# Altium schematic sheet Sheet1.SchDoc
size A4; SheetNumber: 1; SheetTotal: 1
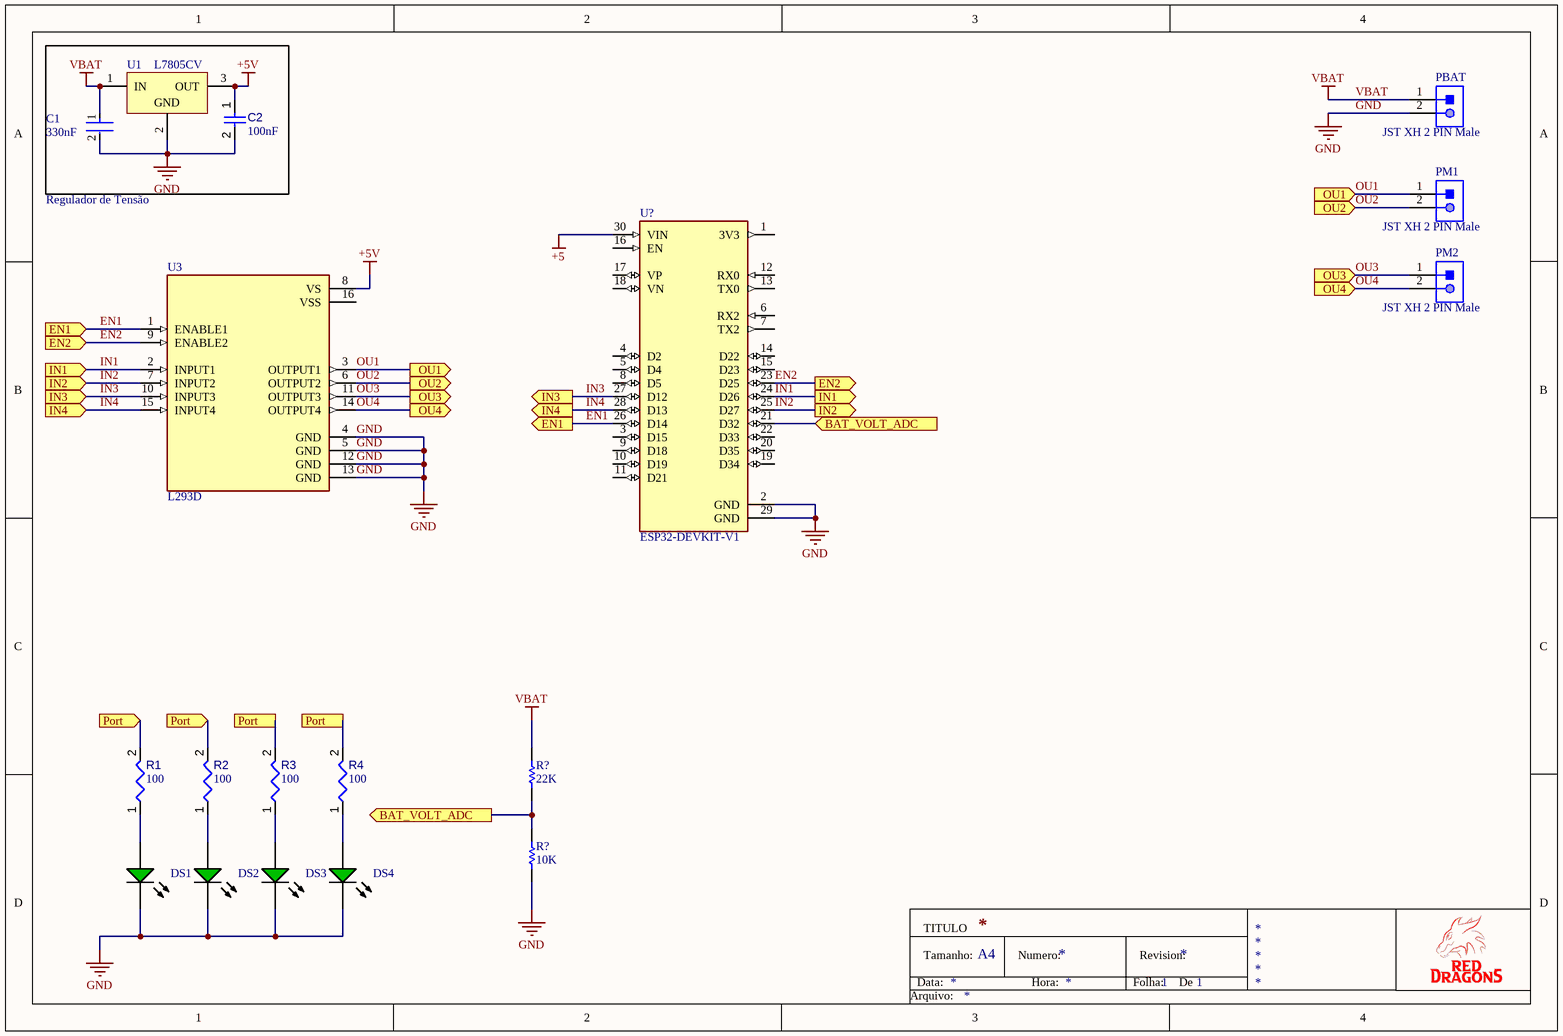
[diagram p0: Sheet1.SchDoc]

## Parts
(Parts that share a designator on the sheet are numbered #1, #2 ... from top to bottom, then left to right.)
C1  330nF  [FP-0805-L_2_01_0_2-W_1_25-IPC_B]
C2  value 100nF  [CAPC1005X56X25LL10T15]  (hidden comment: Capacitor 0.1 uF +/- 5% 16 V 0402)
DS1  LTL-1CHG  [LTST-LTL-1CHG-2]  (value not drawn)
DS2  LTL-1CHG  [LTST-LTL-1CHG-2]  (value not drawn)
DS3  LTL-1CHG  [LTST-LTL-1CHG-2]  (value not drawn)
DS4  LTL-1CHG  [LTST-LTL-1CHG-2]  (value not drawn)
PBAT  JST XH 2 PIN Male  [JST-S2B-PH-K-S_V]
PM1  JST XH 2 PIN Male  [JST-S2B-PH-K-S_V]
PM2  JST XH 2 PIN Male  [JST-S2B-PH-K-S_V]
R1  value 100  [RESC0402(1005)_L]  (hidden comment: 100R2F)
R2  value 100  [RESC0402(1005)_L]  (hidden comment: 100R2F)
R3  value 100  [RESC0402(1005)_L]  (hidden comment: 100R2F)
R4  value 100  [RESC0402(1005)_L]  (hidden comment: 100R2F)
R?#1  value 22K  [RES0805]  (hidden comment: Res1)
R?#2  value 10K  [RES0805]  (hidden comment: Res1)
U1  L7805CV  [TO220]
U3  L293D  [DIP880W50P254L2000H510Q16]
U?  ESP32-DEVKIT-V1  [MODULE_ESP32_DEVKIT_V1]

## Ports
BAT_VOLT_ADC (in), BAT_VOLT_ADC (out), EN1 (in), EN1 (out), EN2 (in), EN2 (out), IN1 (in), IN1 (out), IN2 (in), IN2 (out), IN3 (in), IN3 (out), IN4 (in), IN4 (out), OU1 (in), OU1 (out), OU2 (in), OU2 (out), OU3 (in), OU3 (out), OU4 (in), OU4 (out), Port, Port (in)

## Nets
+5: U?.30(VIN)
+5V: C2.1 U1.3(OUT) U3.8(VS)
GND: C1.2 C2.2 DS1.2(K) DS2.2(K) DS3.2(K) DS4.2(K) PBAT.2 R?#2.1 U1.2(GND) U3.4(GND) U3.5(GND) U3.12(GND) U3.13(GND) U?.2(GND) U?.29(GND)
VBAT: C1.1 PBAT.1 R?#1.2 U1.1(IN)
BAT_VOLT_ADC: R?#1.1 R?#2.2 U?.21(D32) ; port BAT_VOLT_ADC
EN1: U3.1(ENABLE1) U?.26(D14) ; port EN1
EN2: U3.9(ENABLE2) U?.23(D25) ; port EN2
IN1: U3.2(INPUT1) U?.24(D26) ; port IN1
IN2: U3.7(INPUT2) U?.25(D27) ; port IN2
IN3: U3.10(INPUT3) U?.27(D12) ; port IN3
IN4: U3.15(INPUT4) U?.28(D13) ; port IN4
OU1: PM1.1 U3.3(OUTPUT1) ; port OU1
OU2: PM1.2 U3.6(OUTPUT2) ; port OU2
OU3: PM2.1 U3.11(OUTPUT3) ; port OU3
OU4: PM2.2 U3.14(OUTPUT4) ; port OU4
Port: R1.2 R2.2 R3.2 R4.2 ; port Port
NetDS1_1: DS1.1(A) R1.1
NetDS2_1: DS2.1(A) R2.1
NetDS3_1: DS3.1(A) R3.1
NetDS4_1: DS4.1(A) R4.1

Not connected (* = marked no-connect by the designer): U3 16(VSS); U? 1(3V3) 3(D15) 4(D2) 5(D4) 6(RX2) 7(TX2) 8(D5) 9(D18) 10(D19) 11(D21) 12(RX0) 13(TX0) 14(D22) 15(D23) 16(EN) 17(VP) 18(VN) 19(D34) 20(D35) 22(D33)

## Notes on the sheet
- Regulador de Tensão
- Data:
- TITULO
- Tamanho:
- A4
- Numero:
- Hora:
- Folha:
- Revision:
- De
- Arquivo:

## Library data of the parts
C1 = CMP-2007-04657-2: General Purpose Ceramic Capacitor, 0805, 330nF, 10%, X7R, 15%, 16V; Dissipation Factor: 3.5%; Insulation Resistance: 100GR; RoHS Compliant: Yes; Tolerance: 10%; Packaging: Tape and Reel; Radiation Hardening: No; Depth: 1.25mm; Voltage Rating (DC): 16V; Height: 1.4mm; Package Quantity: 1; Case Code (Imperial): 0805; Min Operating Temperature: -55°C; Thickness: 0.055inch; REACH SVHC: No SVHC; Capacitance: 330nF; Voltage Rating: 16V; Size: 1.4mm; Case Code (Metric): 2012; Width: 1.25mm; Max Operating Temperature: 125°C; Voltage: 16V; Series: -; Mount: Surface Mount; Dielectric: X7R; Termination: SMD/SMT; Number of Pins: 2; Contact Plating: Tin; Lead Free: Lead Free; Construction: Flat; Case/Package: 0805; Length: 2.01mm
C2 = CMP-001-00001-6: Chip Capacitor, 0.1 uF, +/- 5%, 16 V, 0402 (1005 Metric); Capacitor Type: Ceramic; Voltage Rating: 16V; Max Operating Temperature: 125°C; Min Operating Temperature: -55°C; Case/Package: 0402; Mounting Technology: SM; Pins: 2; Tolerance: 5%; RoHS Compliant: True
DS1-DS4 = CMP-007-00019-2: LED Uni-Color Green, 100 mW, 30 mA, -55 to 100 degC, 2-Pin THD, RoHS, Bulk; Manufacturer: Lite-On; Power: 100mW; Forward Voltage: 2.6V; Forward Current: 30mA; Nominal Vf: 2.1V; Lens Style: Dome; Viewing Angle: 60degrees; Luminous Intensity: 12.6mcd; Max Operating Temperature: 100°C; Case/Package: Radial; Package Reference: LTL-1CHG; Manufacturer URL: http://www.us.liteon.com/; Package Quantity: 1000; Colour: Green; Packaging: Bulk; RoHS Compliant: True; Datasheet URL: http://datasheet.octopart.com/LTL-1CHG-Lite-On-datasheet-143841.pdf; Package Description: 2-Pin Through Hole Device, Dia 3.8 mm; Min Operating Temperature: -55°C; Mounting Technology: TH; Pins: 2; Illumination Colour: Green; Datasheet Version: Mar-00
PBAT PM1 PM2 = CMP-002-00030-2: Male Header, Pitch 2 mm, 1 x 2 Position, Height 4.8 mm, Tail Length 3.4 mm, -25 to 85 degC, RoHS, Bulk; Manufacturer: Japan Solderless Terminals; Package Reference: S2B-PH-K-S; Case/Package: S2B-PH-K-S; Datasheet URL: http://www.jst-mfg.com/product/pdf/eng/ePH.pdf; RoHS Compliant: Unknown; Datasheet Version: Dec-12; Gender: Male; Min Operating Temperature: -25°C; Max Operating Temperature: 85°C; Package Description: Male Header, Pitch 2 mm, 1 x 2 Position, Height 4.8 mm, Tail Length 3.4 mm; Connector Type: Header; Mounting Technology: SM
R1-R4 = CMP-009-00065-2: 100R 0.063W 1% 0402 (1005 Metric)  SMD; Power: 63mW; Tolerance: 1%; Case/Package: 0402; Pins: 2; Mounting Technology: SMT
R?#1 R?#2 = Res1: Resistor; Published: 8-Jun-2000; LatestRevisionDate: 17-Jul-2002; LatestRevisionNote: Re-released for DXP Platform.; PackageReference: AXIAL-0.3; Publisher: Altium Limited; PackageDescription: Axial Device, Thru-Hole; 2 Leads; 0.3 in Pin Spacing
U1 = CMP-019-00018-3: Positive Voltage Regulator IC, 1.5 A, 5 V, 0 to 125 degC, 3-Pin TO-220, RoHS, Tube; Manufacturer: STMicroelectronics; Max Input Voltage: 35V; Min Supply Voltage: 8V; Nominal Output Voltage: 5V; Outputs: 1; Output Current: 1.5A; Dropout Voltage: 2V; Max Supply Voltage: 20V; Min Input Voltage: 7V; Datasheet Version: Rev 30, 09/2012; Min Operating Temperature: 0°C; Manufacturer URL: http://www.st.com/; Pins: 3; Mounting Technology: TH; Output Voltage: 5V; RoHS Compliant: True; Max Ouput Current: 1.5A; Datasheet URL: https://datasheet.ciiva.com/15111/getdatasheetpartid-44136-15111027.pdf; Packaging: Rail/Tube; Max Operating Temperature: 125°C; Case/Package: TO-220; Package Quantity: 50
U3 = L293D: 4-Channel Motor Driver 24V 16-Pin Power PDIP Tube; MF: {'manufacturer': u'STMicroelectronics'}; Availability: Unavailable; Price: None; MP: L293D; Package: None; Value: *
U? = ESP32-DEVKIT-V1: Dual core, Wi-Fi: 2.4 GHz up to 150 Mbits/s,BLE (Bluetooth Low Energy) and legacy Bluetooth, 32 bits, Up to 240 MHz; MF: {'manufacturer': u'Do it'}; Availability: Unavailable; Price: None; Value: *; MP: ESP32-DEVKIT-V1; Package: None